# EAGLE design TG-Watch02A-Flex-v2 (EAGLE 9.5.1)
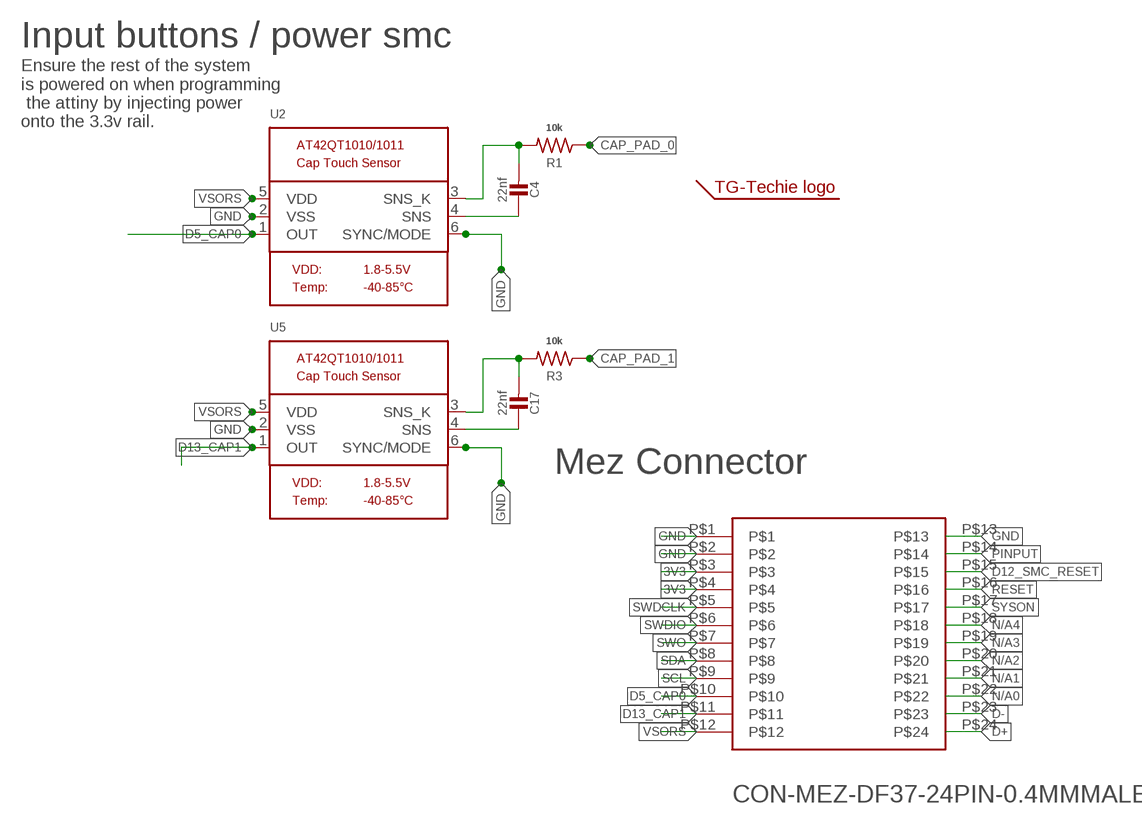
[diagram p0: schematic, sheet 1]

## Parts
C4  22nf  CAP_CERAMIC_0402  [_0402]
C17  22nf  CAP_CERAMIC_0402  [_0402]
R1  10k  R_TG_0402  [TG_0402]
R3  10k  R_TG_0402  [TG_0402]
U2  SEN-CAPTOUCH-AT42QT1010/1  [MICROBUILDER_SOT23-6]
U5  SEN-CAPTOUCH-AT42QT1010/1  [MICROBUILDER_SOT23-6]
U$1  LOGO-TG-TECHIE2.5MM-SYMB  [TG-LOGO-2.5MM-SYMB]
U$11  CON-MEZ-DF37-24PIN-0.4MMMALE  [MEZ-DF37B-24DP]

## Nets
3V3 [power]: U$11.P$3 U$11.P$4
CAP_PAD_0: R1.1
CAP_PAD_1: R3.1
D5_CAP0: U2.1(OUT) U$11.P$10
D12_SMC_RESET: U$11.P$15
D13_CAP1: U5.1(OUT) U$11.P$11
D+: U$11.P$24
D-: U$11.P$23
GND: U2.2(VSS) U2.6(SYNC/MODE) U5.2(VSS) U5.6(SYNC/MODE) U$11.P$1 U$11.P$2 U$11.P$13
N$6: C4.1 U2.4(SNS)
N$9: C4.2 R1.2 U2.3(SNS_K)
N$10: C17.1 U5.4(SNS)
N$11: C17.2 R3.2 U5.3(SNS_K)
N/A0: U$11.P$22
N/A1: U$11.P$21
N/A2: U$11.P$20
N/A3: U$11.P$19
N/A4: U$11.P$18
PINPUT: U$11.P$14
RESET: U$11.P$16
SCL: U$11.P$9
SDA: U$11.P$8
SWDCLK: U$11.P$5
SWDIO: U$11.P$6
SWO: U$11.P$7
SYSON: U$11.P$17
VSORS: U2.5(VDD) U5.5(VDD) U$11.P$12

## Notes on the sheet
- Input buttons / power smc
- Ensure the rest of the system 
  is powered on when programming
   the attiny by injecting power 
  onto the 3.3v rail.
- Mez Connector

## Library data of the parts
C4 C17 = microbuilder:CAP_CERAMIC: Ceramic Capacitors For new designs, use the packages preceded by an '_' character since they are more reliable: The following footprints should be used on most boards: _0402 - Standard footprint for regular board layouts _0603 - Standard footprint for regular board layouts _0805 - Standard footprint for regular board layouts _1206 - Standard footprint for regular board layouts For extremely tight-pitch boards where space is at a premium, the following 'micro-pitch' footprints can be used (smaller pads, no silkscreen outline, etc.): _0402MP - Micro-pitch footprint for very dense/compact boards _0603MP - Micro-pitch footprint for very dense/compact boards _0805MP - Micro-pitch footprint for very dense/compact boards _1206MP - Micro-pitch footprint for very dense/compact boards
R1 R3 = 0TG-Lib v01.5:R_TG
U2 U5 = 0TG-Lib v01.5:SEN-CAPTOUCH-AT42QT1010/1: AT42QT1010/1011 - Single Button Cap Touch Sensors AT42QT1010 - Auto recalibration AT42QT1011 - Remains on as long as touch is detected from: adafruit
U$1 = 0TG-Lib v01.5:LOGO-TG-TECHIE
U$11 = 0TG-Lib v01.4:CON-MEZ-DF37-24PIN-0.4MM: digikey parts: ‎DF37NB-24DS-0.4V, ‎DF37B-24DP-0.4V https://www.digikey.com/product-detail/en/DF37NB-24DS-0.4V(51)/H11850CT-ND/2230650/?itemSeq=306482090 https://www.digikey.com/product-detail/en/DF37B-24DP-0.4V(53)/H11835CT-ND/2230636/?itemSeq=306823575

## Net classes
1 power: width 0.254 mm

## Board
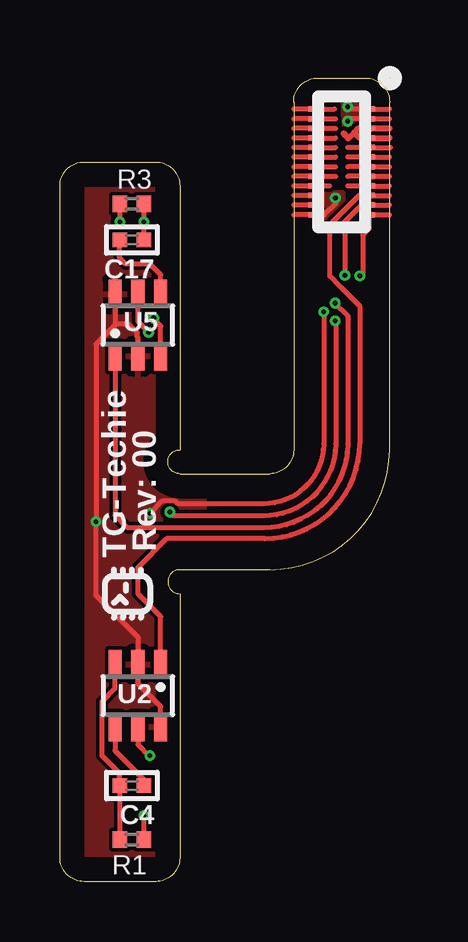
[diagram p1: board, top side]
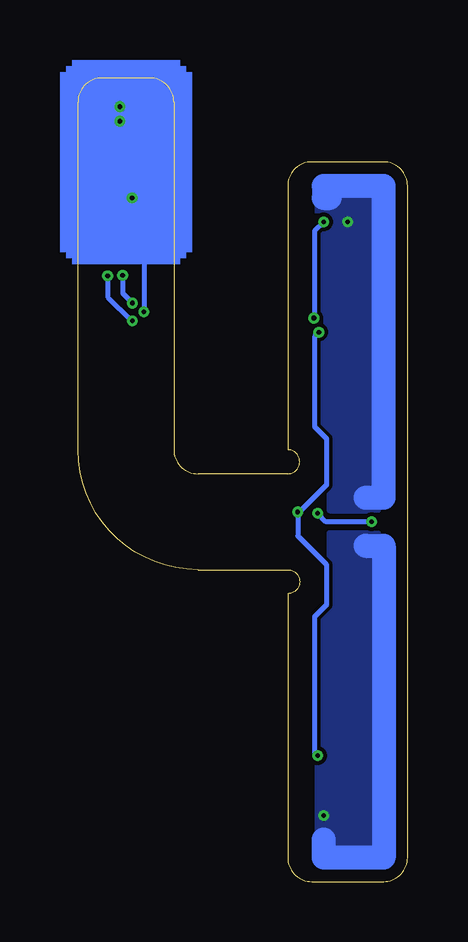
[diagram p2: board, bottom side, seen from below]

Size 13.75 x 33.5 mm. Coordinates in mm from the lower left corner, seen from the top.
Outline: 9.75,32.5 arc-90 10.75,33.5 12.75,33.5 arc-90 13.75,32.5 13.75,18 arc-90 8.75,13 5,13 arc90 4.5,12.5 arc90 5,12 5,1 arc-90 4,0 1,0 arc-90 0,1 0,29 arc-90 1,30 4,30 arc-90 5,29 5,18 arc90 4.5,17.5 arc90 5,17 8.75,17 arc90 9.75,18 9.75,32.5
Copper layers (1*16): Top 0.035mm / dielectric 0.53mm / Bottom 0.035mm
Design rules "default": minimum track width 0.2mm, minimum drill 0.2mm, track to track 6mil, track to pad 6mil, pad to pad 6mil, via to via 6mil, smd to smd 6mil, copper to edge 40mil, drill to drill 6mil, minimum pad ring 10mil, minimum via ring 0.125mm, stop-mask expansion 4mil, vias tented up to drill 10000mil, thermal gap 10mil

### Footprints (pad centres in the part's own frame; a part is rotated, then mirrored left to right if it is on the bottom)
_0402 = smd 0.6 x 0.6: 1 -0.508,0; 2 0.508,0
TG_0402 = smd 0.6 x 0.7: 1 -0.5,0; 2 0.5,0
MICROBUILDER_SOT23-6 = smd 0.55 x 1.2: 1 -0.95,-1.3; 2 0,-1.3; 3 0.95,-1.3; 4 0.95,1.3; 5 0,1.3; 6 -0.95,1.3
MEZ-DF37B-24DP = smd 0.23 x 0.51: P$1 -2.2,1.14; P$2 -1.8,1.14; P$3 -1.4,1.14; P$4 -1,1.14; P$5 -0.6,1.14; P$6 -0.2,1.14; P$7 0.2,1.14; P$8 0.6,1.14; P$9 1,1.14; P$10 1.4,1.14; P$11 1.8,1.14; P$12 2.2,1.14; P$13 2.2,-1.14; P$14 1.8,-1.14; P$15 1.4,-1.14; P$16 1,-1.14; P$17 0.6,-1.14; P$18 0.2,-1.14; P$19 -0.2,-1.14; P$20 -0.6,-1.14; P$21 -1,-1.14; P$22 -1.4,-1.14; P$23 -1.8,-1.14; P$24 -2.2,-1.14

### Placement (x,y rotation side)
C4  3,4 180 top
C17  3,26.75 0 top
R1  3,1.75 180 top
R3  3,28.25 0 top
U2  3.25,7.75 180 top
U5  3.25,23.2 0 top
U$1  3,12 90 top
U$11  11.75,30 270 top

### Tracks (layer width: path | path; a pad name or v marks a point on that pad's centre or on a via)
3V3
  Top 0.254: 12.28,31.23 12.45,31.4 U$11.P$3 13.75,31.4 | 12.28,31.23 12.5,31 U$11.P$4 13.75,31 | 12.28,31.23 12.03,30.98 11.88,31.13 11.88,31.16 11.84,31.2
CAP_PAD_0  (via drill 0.2)
  Top 0.2: R1.1 v3.5,2.75
  Bottom 1: 1.75,14 1,14 1,1 3.5,1 R1.1
  pour Bottom: 3.75,10.75 3.75,1.25 1.25,1.25 1.25,14.5 3.25,14.5 3.25,11.25
CAP_PAD_1  (via drill 0.2)
  Top 0.2: v2.5,27.5 R3.1
  Bottom 1: 3.25,28.5 3.5,28.5 3.5,29 1,29 1,16 1.75,16
  pour Bottom: 3.25,15.5 1.25,15.5 1.25,28.75 3.75,28.75 3.75,18.5 3.25,18
D5_CAP0
  Top 0.2: U2.1 4.2,11.05 3.25,12 3.25,13.1 4.45,14.3 8.55,14.3 arc90 12.5,18.25 12.5,24 11.7,24.8 11.68,24.8 11.25,25.23 11.25,27.39 12.46,28.6 U$11.P$10 13.75,28.6
D12_SMC_RESET
  Top 0.2: U$11.P$15 9.75,28.6
D13_CAP1  (via drill 0.2)
  Top 0.2: v11.88,25.27 11.88,27.52 12.56,28.2 U$11.P$11 13.75,28.2 | U5.1 2.3,15.28 2.83,14.75 8.5,14.75 arc90 12,18.25 12,23.6 v11.48,24.12
  Bottom 0.2: v11.88,25.27 11.88,24.52 v11.48,24.12
D+
  Top 0.2: 11.45,32.2 U$11.P$24 9.75,32.2
D-
  Top 0.2: 11.5,31.8 U$11.P$23 9.75,31.8
GND  (via drill 0.2)
  Top 0.2: U5.6 2.3,23.25 | 2.3,23.25 2.3,23.2 1.5,22.4 v1.5,15 1.5,11.92 3.25,10.17 U2.2 3.25,8.25 4.2,7.3 U2.6 | 3.25,22.25 U5.2 3.25,22.68 3.22,22.7 3.22,22.88 2.85,23.25 2.3,23.25 | v11.49,28.5 11.49,28.25 11.04,27.8 U$11.P$13 9.75,27.8 | v12,31.7 12.1,31.8 U$11.P$2 13.75,31.8 | v12,32.3 12.1,32.2 U$11.P$1 13.75,32.2 | v11,23.75 11,18.25 arc-90 8.5,15.75 4.91,15.75 4.78,15.88 4.28,15.88 v3.75,15.35
  Bottom 0.2: v12,32.3 v12,31.7 12,29.01 v11.49,28.5 11.49,27.75 11.5,27.75 11,27.25 v11,23.75 | v1.5,15 3.4,15 v3.75,15.35
  pour Top: 16,24.5 16,35.45 6.7,35.45 6.7,24.5
  pour Top: -1,31 6,31 6,-1 -1,-1
N$6
  Top 0.2: U2.4 2.3,5.45 3.51,4.24 C4.1
N$9
  Top 0.2: R1.2 C4.2 2.49,4.51 1.75,5.25 1.75,7.5 2.3,8.05 U2.3
N$10
  Top 0.2: U5.4 4.2,25.3 3.75,25.75 2.74,25.75 2.49,26 C17.1
N$11  (via drill 0.2)
  Top 0.2: C17.2 v3.5,27.5 R3.2 | U5.3 4.2,23.15 3.91,23.44 v3.91,23.49
  Bottom 0.2: v3.5,27.5 3.88,27.12 3.88,23.49 v3.91,23.49
N/A0
  Top 0.2: 11.5,31.4 U$11.P$22 9.75,31.4
N/A1
  Top 0.2: 11.5,31 U$11.P$21 9.75,31
N/A2
  Top 0.2: 11.5,30.6 U$11.P$20 9.75,30.6
N/A3
  Top 0.2: 11.5,30.2 U$11.P$19 9.75,30.2
N/A4
  Top 0.2: 11.5,29.8 U$11.P$18 9.75,29.8
PINPUT
  Top 0.2: U$11.P$14 9.75,28.2
RESET
  Top 0.2: 11.25,29 U$11.P$16 9.75,29
SCL
  Top 0.2: 12,29 U$11.P$9 13.75,29
SDA
  Top 0.2: 12,29.4 U$11.P$8 13.75,29.4
SWDCLK
  Top 0.2: 12,30.6 U$11.P$5 13.8,30.6
SWDIO
  Top 0.2: 12,30.2 U$11.P$6 13.75,30.2
SWO
  Top 0.2: 12,29.8 U$11.P$7 13.75,29.8
SYSON
  Top 0.2: 11.5,29.4 U$11.P$17 9.75,29.4
VSORS  (via drill 0.2)
  Top 0.2: v3.7,22.9 3.25,23.35 U5.5 | v3.75,5.25 3.7,5.25 3.25,5.7 U2.5 | v12.51,25.25 12.63,25.38 12.63,26.96 12.89,27.22 U$11.P$12 13.75,27.8 | v11.48,23.38 11.5,23.35 11.5,18.25 arc-90 8.5,15.25 4.74,15.25 v4.58,15.41
  Bottom 0.2: v3.7,22.9 3.88,22.72 3.88,18.96 3.38,18.46 3.38,16.54 4.51,15.41 v4.58,15.41 4.58,14.41 3.38,13.21 3.38,11.54 3.88,11.04 3.88,5.38 v3.75,5.25 | v12.51,25.25 12.51,24.38 11.51,23.38 v11.48,23.38
(copper drawn outside any net)
  shapes: Bottom area x3

### Text on the board
tPlace: TG-Techie | Rev: 00